# Altium schematic sheet STM32.SchDoc
size A4
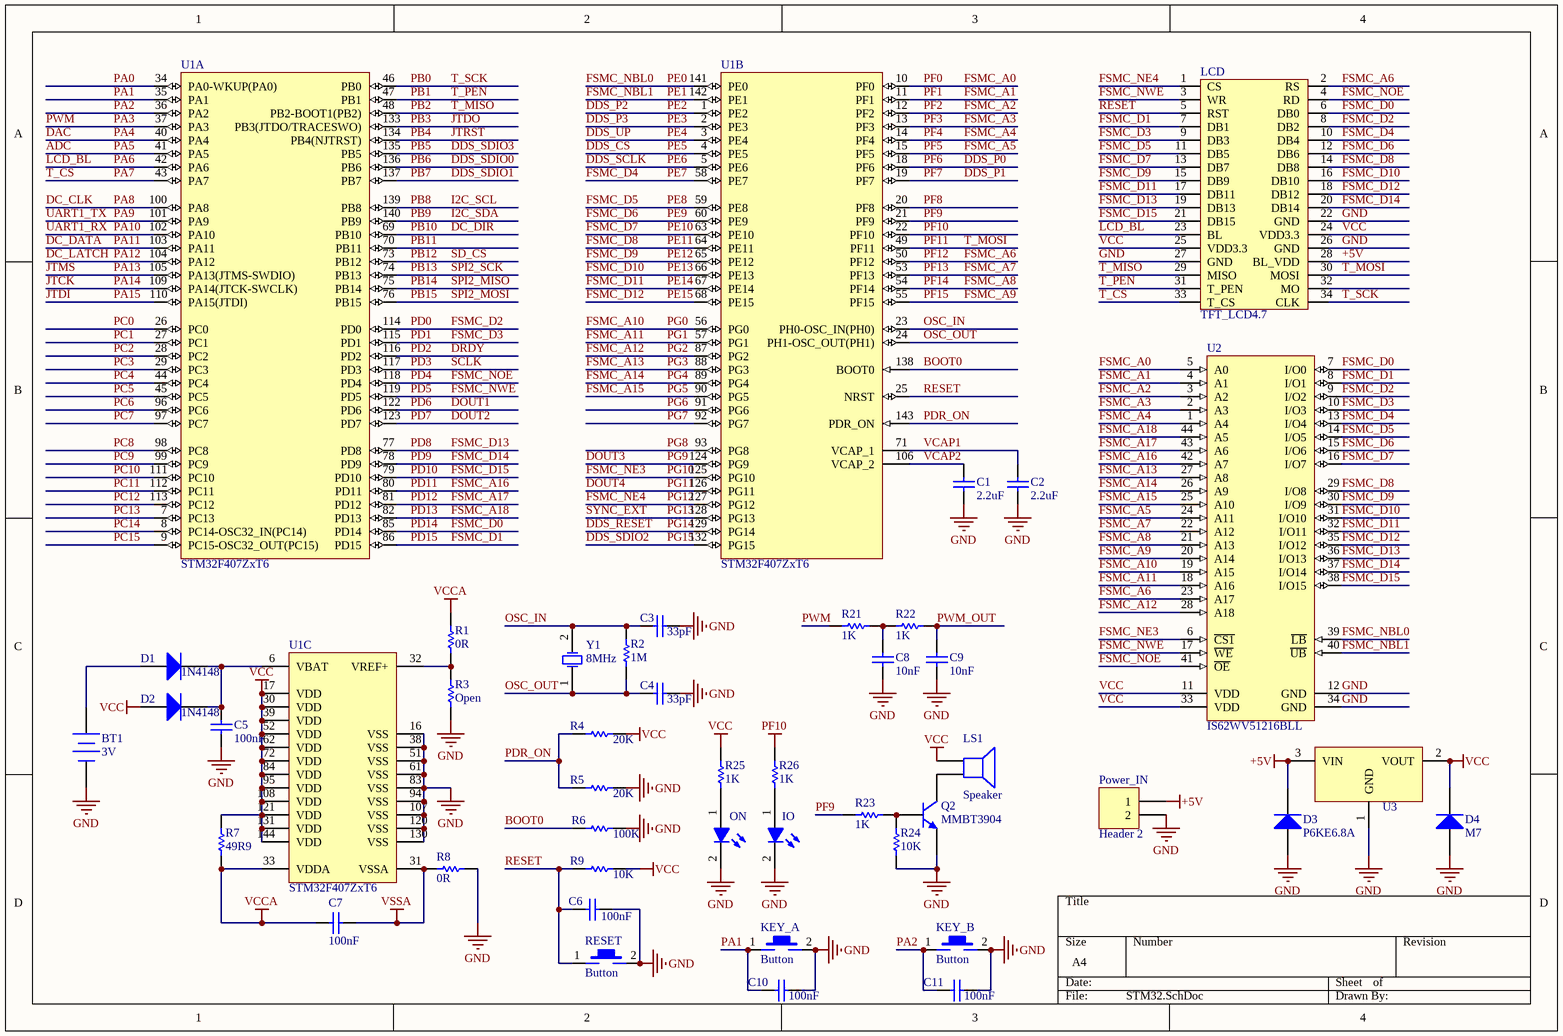
[diagram p0: STM32.SchDoc]

## Parts
BT1  3V  [BAT-2]
C1  2.2uF  [CAPC0603(1608)55_M]
C2  2.2uF  [CAPC0603(1608)55_M]
C3  33pF  [CAPC0603(1608)55_M]
C4  33pF  [CAPC0603(1608)55_M]
C5  100nF  [CAPC0603(1608)55_M]
C6  100nF  [CAPC0603(1608)55_M]
C7  100nF  [CAPC0603(1608)55_M]
C8  10nF  [CAPC0603(1608)55_M]
C9  10nF  [CAPC0603(1608)55_M]
C10  100nF  [CAPC0603(1608)55_M]
C11  100nF  [CAPC0603(1608)55_M]
D1  1N4148  [LL34]
D2  1N4148  [LL34]
D3  P6KE6.8A  [DO-214AC]
D4  M7  [DO-214AC]
IO  LED-BLUE  [0603LED_BLUE_V]  (value not drawn)
KEY_A  Button  [Button665]
KEY_B  Button  [Button665]
LCD  TFT_LCD4.7  [DB2*17-3.5]
LS1  Speaker  [Buzzer]
ON  LED-BLUE  [0603LED_BLUE_V]  (value not drawn)
Power_IN  Header 2  [VH3.96-2-AW]
Q2  MMBT3904  [SOT23_M]
R1  0R  [RESC0603(1608)_M]
R2  1M  [RESC0603(1608)_M]
R3  Open  [RESC0603(1608)_M]
R4  20K  [RESC0603(1608)_M]
R5  20K  [RESC0603(1608)_M]
R6  100K  [RESC0603(1608)_M]
R7  49R9  [RESC0603(1608)_M]
R8  0R  [RESC0603(1608)_M]
R9  10K  [RESC0603(1608)_M]
R21  1K  [RESC0603(1608)_M]
R22  1K  [RESC0603(1608)_M]
R23  1K  [RESC0603(1608)_M]
R24  10K  [RESC0603(1608)_M]
R25  1K  [RESC0603(1608)_M]
R26  1K  [RESC0603(1608)_M]
RESET  Button  [Button665]
U1  STM32F407ZxT6  [LQFP144]  (parts A,B,C of 3)
U2  IS62WV51216BLL  [TSOP-2-44]
U3  AMS1117  [SOT-223_M]  (value not drawn)
Y1  8MHz  [HC-49S]

## Nets
+5V: D3.1(K) LCD.28(BL_VDD) Power_IN.1 U3.3(VIN)
GND: BT1.2(-) C1.1 C2.1 C3.2 C4.2 C5.2 C6.2 C8.1 C9.1 C10.2 C11.2 D3.2(A) D4.2(A) IO.2(K) KEY_A.2 KEY_B.2 LCD.22(GND) LCD.26(GND) LCD.27(GND) ON.2(K) Power_IN.2 Q2.2(E) R3.1 R5.1 R6.2 R8.2 R24.1 RESET.2 U1.16(VSS) U1.38(VSS) U1.51(VSS) U1.61(VSS) U1.83(VSS) U1.94(VSS) U1.107(VSS) U1.120(VSS) U1.130(VSS) U2.12(GND) U2.34(GND) U3.1(GND)
PF10: R26.2 U1.22(PF10)
VCC: D2.2(A) D4.1(K) LCD.24(VDD3.3) LCD.25(VDD3.3) LS1.1 R4.1 R7.2 R9.2 R25.2 U1.17(VDD) U1.30(VDD) U1.39(VDD) U1.52(VDD) U1.62(VDD) U1.72(VDD) U1.84(VDD) U1.95(VDD) U1.108(VDD) U1.121(VDD) U1.131(VDD) U1.144(VDD) U2.11(VDD) U2.33(VDD) U3.2(VOUT)
VCCA: C7.2 R1.2 R7.1 U1.33(VDDA)
VSSA: C7.1 R8.1 U1.31(VSSA)
ADC: U1.41(PA5)  [also labelled PA5]
BOOT0: R6.1 U1.138(BOOT0)
DAC: U1.40(PA4)  [also labelled PA4]
DC_CLK: U1.100(PA8)  [also labelled PA8]
DC_DATA: U1.103(PA11)  [also labelled PA11]
DC_DIR: U1.69(PB10)  [also labelled PB10]
DC_LATCH: U1.104(PA12)  [also labelled PA12]
DDS_CS: U1.4(PE5)  [also labelled PE5]
DDS_P0: U1.18(PF6)  [also labelled PF6]
DDS_P1: U1.19(PF7)  [also labelled PF7]
DDS_P2: U1.1(PE2)  [also labelled PE2]
DDS_P3: U1.2(PE3)  [also labelled PE3]
DDS_RESET: U1.129(PG14)  [also labelled PG14]
DDS_SCLK: U1.5(PE6)  [also labelled PE6]
DDS_SDIO0: U1.136(PB6)  [also labelled PB6]
DDS_SDIO1: U1.137(PB7)  [also labelled PB7]
DDS_SDIO2: U1.132(PG15)  [also labelled PG15]
DDS_SDIO3: U1.135(PB5)  [also labelled PB5]
DDS_UP: U1.3(PE4)  [also labelled PE4]
DOUT1: U1.122(PD6)  [also labelled PD6]
DOUT2: U1.123(PD7)  [also labelled PD7]
DOUT3: U1.124(PG9)  [also labelled PG9]
DOUT4: U1.126(PG11)  [also labelled PG11]
DRDY: U1.116(PD2)  [also labelled PD2]
FSMC_A0: U1.10(PF0) U2.5(A0)  [also labelled PF0]
FSMC_A1: U1.11(PF1) U2.4(A1)  [also labelled PF1]
FSMC_A2: U1.12(PF2) U2.3(A2)  [also labelled PF2]
FSMC_A3: U1.13(PF3) U2.2(A3)  [also labelled PF3]
FSMC_A4: U1.14(PF4) U2.1(A4)  [also labelled PF4]
FSMC_A5: U1.15(PF5) U2.24(A11)  [also labelled PF5]
FSMC_A6: LCD.2(RS) U1.50(PF12) U2.23(A17)  [also labelled PF12]
FSMC_A7: U1.53(PF13) U2.22(A12)  [also labelled PF13]
FSMC_A8: U1.54(PF14) U2.21(A13)  [also labelled PF14]
FSMC_A9: U1.55(PF15) U2.20(A14)  [also labelled PF15]
FSMC_A10: U1.56(PG0) U2.19(A15)  [also labelled PG0]
FSMC_A11: U1.57(PG1) U2.18(A16)  [also labelled PG1]
FSMC_A12: U1.87(PG2) U2.28(A18)  [also labelled PG2]
FSMC_A13: U1.88(PG3) U2.27(A8)  [also labelled PG3]
FSMC_A14: U1.89(PG4) U2.26(A9)  [also labelled PG4]
FSMC_A15: U1.90(PG5) U2.25(A10)  [also labelled PG5]
FSMC_A16: U1.80(PD11) U2.42(A7)  [also labelled PD11]
FSMC_A17: U1.81(PD12) U2.43(A6)  [also labelled PD12]
FSMC_A18: U1.82(PD13) U2.44(A5)  [also labelled PD13]
FSMC_D0: LCD.6(DB0) U1.85(PD14) U2.7(I/O0)  [also labelled PD14]
FSMC_D1: LCD.7(DB1) U1.86(PD15) U2.8(I/O1)  [also labelled PD15]
FSMC_D2: LCD.8(DB2) U1.114(PD0) U2.9(I/O2)  [also labelled PD0]
FSMC_D3: LCD.9(DB3) U1.115(PD1) U2.10(I/O3)  [also labelled PD1]
FSMC_D4: LCD.10(DB4) U1.58(PE7) U2.13(I/O4)  [also labelled PE7]
FSMC_D5: LCD.11(DB5) U1.59(PE8) U2.14(I/O5)  [also labelled PE8]
FSMC_D6: LCD.12(DB6) U1.60(PE9) U2.15(I/O6)  [also labelled PE9]
FSMC_D7: LCD.13(DB7) U1.63(PE10) U2.16(I/O7)  [also labelled PE10]
FSMC_D8: LCD.14(DB8) U1.64(PE11) U2.29(I/O8)  [also labelled PE11]
FSMC_D9: LCD.15(DB9) U1.65(PE12) U2.30(I/O9)  [also labelled PE12]
FSMC_D10: LCD.16(DB10) U1.66(PE13) U2.31(I/O10)  [also labelled PE13]
FSMC_D11: LCD.17(DB11) U1.67(PE14) U2.32(I/O11)  [also labelled PE14]
FSMC_D12: LCD.18(DB12) U1.68(PE15) U2.35(I/O12)  [also labelled PE15]
FSMC_D13: LCD.19(DB13) U1.77(PD8) U2.36(I/O13)  [also labelled PD8]
FSMC_D14: LCD.20(DB14) U1.78(PD9) U2.37(I/O14)  [also labelled PD9]
FSMC_D15: LCD.21(DB15) U1.79(PD10) U2.38(I/O15)  [also labelled PD10]
FSMC_NBL0: U1.141(PE0) U2.39(~{LB})  [also labelled PE0]
FSMC_NBL1: U1.142(PE1) U2.40(~{UB})  [also labelled PE1]
FSMC_NE3: U1.125(PG10) U2.6(~{CS1})  [also labelled PG10]
FSMC_NE4: LCD.1(CS) U1.127(PG12)  [also labelled PG12]
FSMC_NOE: LCD.4(RD) U1.118(PD4) U2.41(~{OE})  [also labelled PD4]
FSMC_NWE: LCD.3(WR) U1.119(PD5) U2.17(~{WE})  [also labelled PD5]
I2C_SCL: U1.139(PB8)  [also labelled PB8]
I2C_SDA: U1.140(PB9)  [also labelled PB9]
JTCK: U1.109(PA14(JTCK-SWCLK))  [also labelled PA14]
JTDI: U1.110(PA15(JTDI))  [also labelled PA15]
JTDO: U1.133(PB3(JTDO/TRACESWO))  [also labelled PB3]
JTMS: U1.105(PA13(JTMS-SWDIO))  [also labelled PA13]
JTRST: U1.134(PB4(NJTRST))  [also labelled PB4]
LCD_BL: LCD.23(BL) U1.42(PA6)  [also labelled PA6]
OSC_IN: C3.1 R2.2 U1.23(PH0-OSC_IN(PH0)) Y1.2(OSC2)
OSC_OUT: C4.1 R2.1 U1.24(PH1-OSC_OUT(PH1)) Y1.1(OSC1)
PA0: U1.34(PA0-WKUP(PA0))
PA1: C10.1 KEY_A.1 U1.35(PA1)
PA2: C11.1 KEY_B.1 U1.36(PA2)
PA3: R21.1 U1.37(PA3)  [also labelled PWM]
PA7: LCD.33(T_CS) U1.43(PA7)  [also labelled T_CS]
PA9: U1.101(PA9)  [also labelled UART1_TX]
PA10: U1.102(PA10)  [also labelled UART1_RX]
PB0: LCD.34(CLK) U1.46(PB0)  [also labelled T_SCK]
PB1: LCD.31(T_PEN) U1.47(PB1)  [also labelled T_PEN]
PB2: LCD.29(MISO) U1.48(PB2-BOOT1(PB2))  [also labelled T_MISO]
PB11: U1.70(PB11)
PB12: U1.73(PB12)  [also labelled SD_CS]
PB13: U1.74(PB13)  [also labelled SPI2_SCK]
PB14: U1.75(PB14)  [also labelled SPI2_MISO]
PB15: U1.76(PB15)  [also labelled SPI2_MOSI]
PC0: U1.26(PC0)
PC1: U1.27(PC1)
PC2: U1.28(PC2)
PC3: U1.29(PC3)
PC4: U1.44(PC4)
PC5: U1.45(PC5)
PC6: U1.96(PC6)
PC7: U1.97(PC7)
PC8: U1.98(PC8)
PC9: U1.99(PC9)
PC10: U1.111(PC10)
PC11: U1.112(PC11)
PC12: U1.113(PC12)
PC13: U1.7(PC13)
PC14: U1.8(PC14-OSC32_IN(PC14))
PC15: U1.9(PC15-OSC32_OUT(PC15))
PD3: U1.117(PD3)  [also labelled SCLK]
PDR_ON: R4.2 R5.2 U1.143(PDR_ON)
PF8: U1.20(PF8)
PF9: R23.1 U1.21(PF9)
PF11: LCD.30(MOSI) U1.49(PF11)  [also labelled T_MOSI]
PG6: U1.91(PG6)
PG7: U1.92(PG7)
PG8: U1.93(PG8)
PG13: U1.128(PG13)  [also labelled SYNC_EXT]
PWM_OUT: C9.2 R22.2
RESET: C6.1 LCD.5(RST) R9.1 RESET.1 U1.25(NRST)
VCAP1: C2.2 U1.71(VCAP_1)
VCAP2: C1.2 U1.106(VCAP_2)
NetBT1_1: BT1.1(+) D1.2(A)
NetC5_1: C5.1 D1.1(K) D2.1(K) U1.6(VBAT)
NetC8_2: C8.2 R21.2 R22.1
NetIO_1: IO.1(A) R26.1
NetLS1_2: LS1.2 Q2.3(C)
NetON_1: ON.1(A) R25.1
NetQ2_1: Q2.1(B) R23.2 R24.2
NetR1_1: R1.1 R3.2 U1.32(VREF+)

Not connected (* = marked no-connect by the designer): LCD 32(MO)

## Library data of the parts
BT1 = Battery: Multicell Battery; Published: 24-Mar-1999; LatestRevisionDate: 17-Jul-2002; LatestRevisionNote: Re-released for DXP Platform.; PackageReference: BAT-2; Publisher: Altium Limited; PackageDescription: Battery; 2 Leads
C1-C11 = CAP
D1-D4 = Diode: pin to pad: 1>2 2>1
LS1 = Speaker: Loudspeaker; Published: 24-Mar-1999; LatestRevisionDate: 17-Jul-2002; LatestRevisionNote: Re-released for DXP Platform.; PackageReference: PIN2; Publisher: Altium Limited
Power_IN = Header 2: Header, 2-Pin; LatestRevisionDate: 17-Jul-2002; LatestRevisionNote: Re-released for DXP Platform.; Publisher: Altium Limited
Q2 = MMBT3904: NPN General Purpose Amplifier; Published: 8-Jun-2000; LatestRevisionDate: 15-Jan-2003; LatestRevisionNote: PCB Footprint 'BCY-W3/D4.7' replaced; DatasheetVersion: 1997; PackageVersion: Sep-1998; PackageReference: TO-92A; Publisher: Altium Limited; PackageDescription: TO, Flat Index; 3 In-Line, Axial Leads; Body Dia. 4.5mm; Leads 0.51 x 0.48 mm (max); ComponentLink1Description: Manufacturer Link; ComponentLink1URL: http://www.fairchildsemi.com/; ComponentLink2Description: Datasheet; ComponentLink2URL: http://www.fairchildsemi.com/ds/2N%2F2N3904.pdf
R1-R9 R21-R26 = RES
Y1 = XTAL: Crystal Oscillator; Published: 8-Jun-2000; LatestRevisionDate: 17-Jul-2002; LatestRevisionNote: Re-released for DXP Platform.; PackageReference: R38; Publisher: Altium Limited; PackageDescription: Crystal, Thru-Hole; 2 Leads; Body 3.1 x 8.2 mm (Dia.xH)